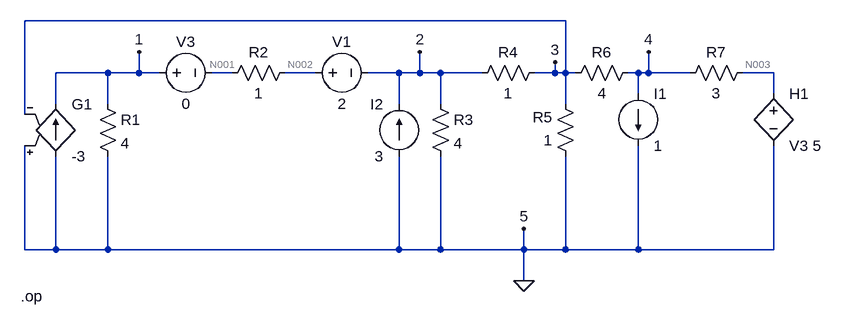
[diagram p0: schematic Draft4.asc]
Draft4.asc, the LTspice schematic file:
Version 4
SHEET 1 880 680
WIRE 240 32 -592 32
WIRE -464 112 -544 112
WIRE -416 112 -416 80
WIRE -416 112 -464 112
WIRE -384 112 -416 112
WIRE -272 112 -304 112
WIRE -144 112 -192 112
WIRE -16 112 -64 112
WIRE 16 112 16 80
WIRE 16 112 -16 112
WIRE 48 112 16 112
WIRE 112 112 48 112
WIRE 224 112 224 96
WIRE 224 112 192 112
WIRE 240 112 240 32
WIRE 240 112 224 112
WIRE 256 112 240 112
WIRE 352 112 336 112
WIRE 368 112 368 80
WIRE 368 112 352 112
WIRE 432 112 368 112
WIRE 560 112 512 112
WIRE 352 144 352 112
WIRE 560 144 560 112
WIRE -544 160 -544 112
WIRE -464 160 -464 112
WIRE -16 160 -16 112
WIRE 48 160 48 112
WIRE 240 160 240 112
WIRE -592 176 -592 32
WIRE -592 384 -592 224
WIRE -544 384 -544 240
WIRE -544 384 -592 384
WIRE -464 384 -464 240
WIRE -464 384 -544 384
WIRE -16 384 -16 240
WIRE -16 384 -464 384
WIRE 48 384 48 240
WIRE 48 384 -16 384
WIRE 176 384 176 352
WIRE 176 384 48 384
WIRE 240 384 240 240
WIRE 240 384 176 384
WIRE 352 384 352 224
WIRE 352 384 240 384
WIRE 560 384 560 224
WIRE 560 384 352 384
WIRE 176 432 176 384
FLAG 176 432 0
FLAG -416 80 1
FLAG 16 80 2
FLAG 224 96 3
FLAG 368 80 4
FLAG 176 352 5
SYMBOL current 352 144 R0
SYMATTR InstName I1
SYMATTR Value 1
SYMBOL res -480 144 R0
SYMATTR InstName R1
SYMATTR Value 4
SYMBOL res -176 96 R90
WINDOW 0 0 56 VBottom 2
WINDOW 3 32 56 VTop 2
SYMATTR InstName R2
SYMATTR Value 1
SYMBOL voltage -160 112 R270
WINDOW 0 32 56 VTop 2
WINDOW 3 -32 56 VBottom 2
SYMATTR InstName V1
SYMATTR Value 2
SYMBOL res 32 144 R0
SYMATTR InstName R3
SYMATTR Value 4
SYMBOL res 208 96 R90
WINDOW 0 0 56 VBottom 2
WINDOW 3 32 56 VTop 2
SYMATTR InstName R4
SYMATTR Value 1
SYMBOL res 256 256 R180
WINDOW 0 36 76 Left 2
WINDOW 3 36 40 Left 2
SYMATTR InstName R5
SYMATTR Value 1
SYMBOL res 240 128 R270
WINDOW 0 32 56 VTop 2
WINDOW 3 0 56 VBottom 2
SYMATTR InstName R6
SYMATTR Value 4
SYMBOL current -16 240 R180
WINDOW 0 24 80 Left 2
WINDOW 3 24 0 Left 2
SYMATTR InstName I2
SYMATTR Value 3
SYMBOL g2 -544 144 R0
SYMATTR InstName G1
SYMATTR Value -3
SYMBOL h 560 128 R0
SYMATTR InstName H1
SYMATTR Value V3 5
SYMBOL voltage -400 112 R270
WINDOW 0 32 56 VTop 2
WINDOW 3 -32 56 VBottom 2
SYMATTR InstName V3
SYMATTR Value 0
SYMBOL res 528 96 R90
WINDOW 0 0 56 VBottom 2
WINDOW 3 32 56 VTop 2
SYMATTR InstName R7
SYMATTR Value 3
TEXT -598 456 Left 2 !.op

The netlist it stands for:
* Draft4.asc
I1 4 0 1
R1 1 0 4
R2 N002 N001 1
V1 N002 2 2
R3 2 0 4
R4 3 2 1
R5 0 3 1
R6 3 4 4
I2 0 2 3
G1 0 1 0 3 -3
H1 N003 0 V3 5
V3 1 N001 0
R7 N003 4 3
.op
.backanno
.end

* Results of the author's LTspice run, read from the files saved beside the schematic
* Operating Point:
*   V(4) = -6.975 V
*   V(1) = 810 mV
*   V(n002) = 2.573 V
*   V(n001) = 810 mV
*   V(2) = 573.2 mV
*   V(3) = -520.2 mV
*   V(n003) = -8.816 V
*   I(H1) = 613.7 mA
*   I(I1) = 1 A
*   I(I2) = 3 A
*   I(R1) = 202.5 mA
*   I(R2) = 1.763 A
*   I(R3) = 143.3 mA
*   I(R4) = -1.093 A
*   I(R5) = 520.2 mA
*   I(R6) = 1.614 A
*   I(R7) = -613.7 mA
*   I(G1) = -1.561 A
*   I(V1) = -1.763 A
*   I(V3) = -1.763 A